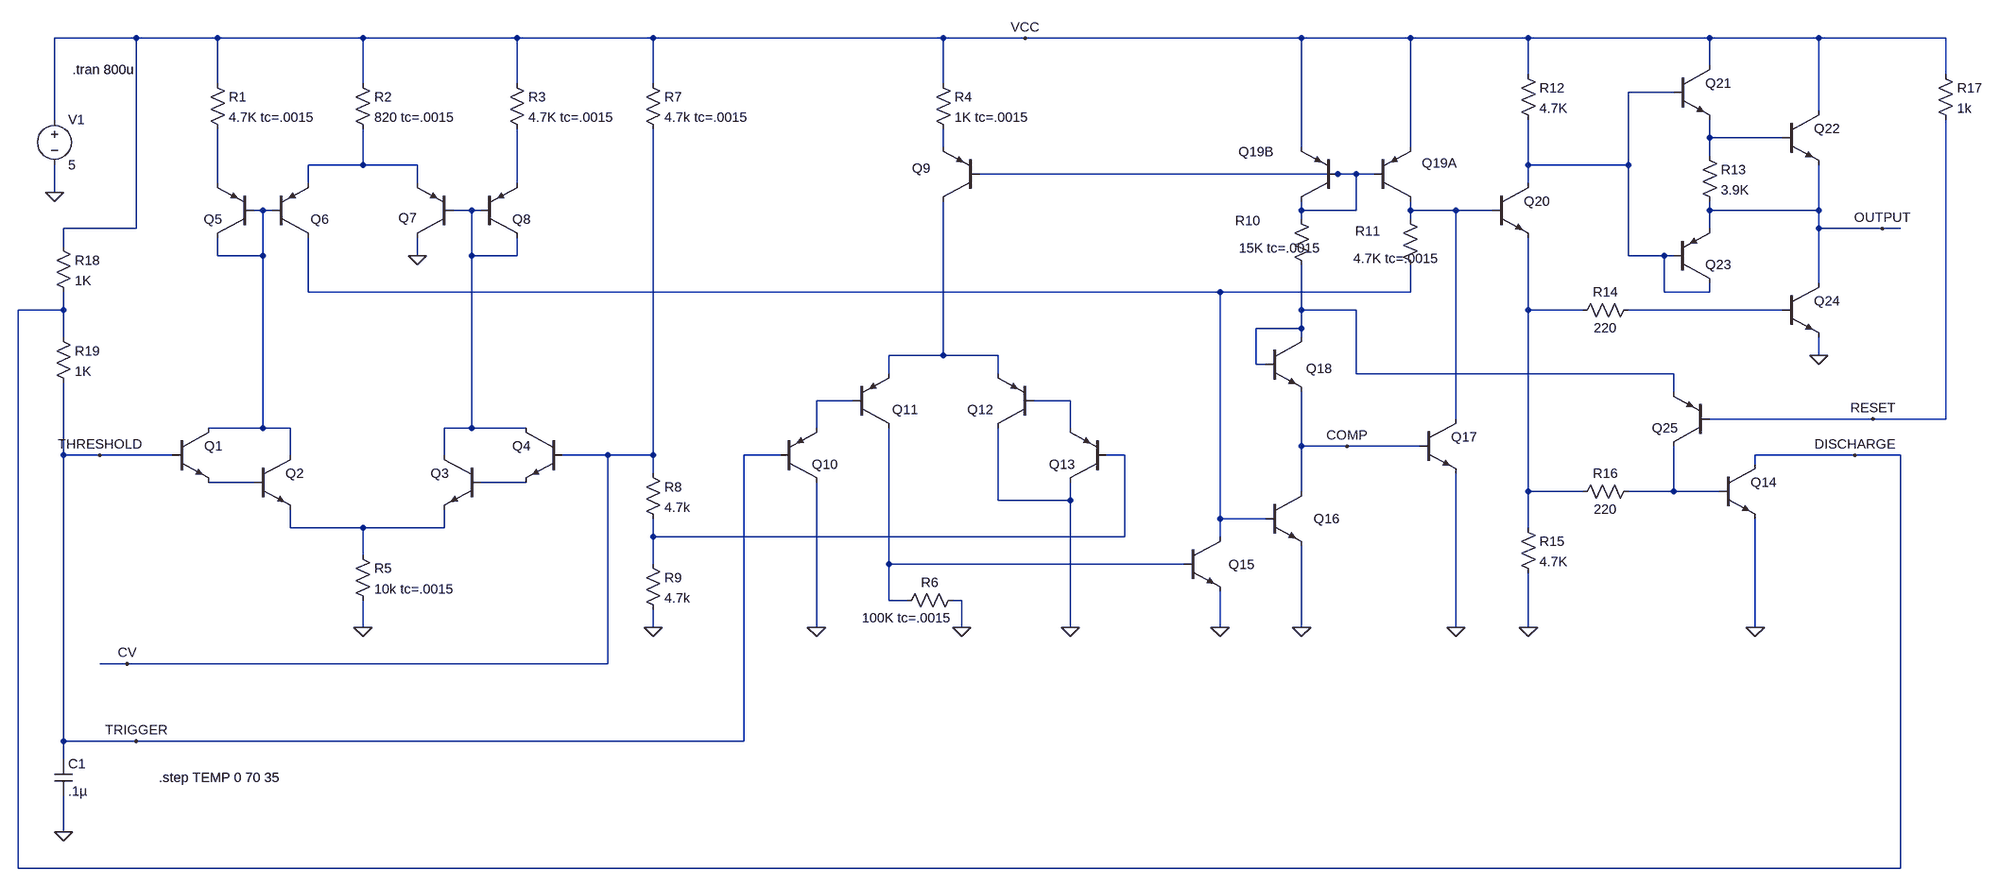
[diagram p0: schematic ne555.asc]
ne555.asc, the LTspice schematic file:
Version 4
SHEET 1 2928 1140
WIRE -384 -352 -528 -352
WIRE -240 -352 -384 -352
WIRE 16 -352 -240 -352
WIRE 288 -352 16 -352
WIRE 528 -352 288 -352
WIRE 1040 -352 528 -352
WIRE 1184 -352 1040 -352
WIRE 1680 -352 1184 -352
WIRE 1872 -352 1680 -352
WIRE 2080 -352 1872 -352
WIRE 2400 -352 2080 -352
WIRE 2592 -352 2400 -352
WIRE 2816 -352 2592 -352
WIRE 2400 -304 2400 -352
WIRE 2080 -288 2080 -352
WIRE 2816 -288 2816 -352
WIRE -240 -272 -240 -352
WIRE 16 -272 16 -352
WIRE 288 -272 288 -352
WIRE 528 -272 528 -352
WIRE 1040 -272 1040 -352
WIRE 2336 -256 2256 -256
WIRE 2592 -224 2592 -352
WIRE -528 -208 -528 -352
WIRE 2400 -176 2400 -208
WIRE 2528 -176 2400 -176
WIRE 1040 -160 1040 -192
WIRE 1680 -160 1680 -352
WIRE 1872 -160 1872 -352
WIRE 2400 -144 2400 -176
WIRE 16 -128 16 -192
WIRE 16 -128 -80 -128
WIRE 112 -128 16 -128
WIRE 2080 -128 2080 -208
WIRE 2256 -128 2256 -256
WIRE 2256 -128 2080 -128
WIRE 1744 -112 1104 -112
WIRE 1776 -112 1744 -112
WIRE 1808 -112 1776 -112
WIRE -240 -96 -240 -192
WIRE -80 -96 -80 -128
WIRE 112 -96 112 -128
WIRE 288 -96 288 -192
WIRE 2080 -96 2080 -128
WIRE -528 -80 -528 -128
WIRE -160 -48 -176 -48
WIRE -144 -48 -160 -48
WIRE 208 -48 176 -48
WIRE 224 -48 208 -48
WIRE 1680 -48 1680 -64
WIRE 1776 -48 1776 -112
WIRE 1776 -48 1680 -48
WIRE 1872 -48 1872 -64
WIRE 1952 -48 1872 -48
WIRE 2016 -48 1952 -48
WIRE 2400 -48 2400 -64
WIRE 2592 -48 2592 -128
WIRE 2592 -48 2400 -48
WIRE 1680 -32 1680 -48
WIRE 1872 -32 1872 -48
WIRE -384 -16 -384 -352
WIRE -384 -16 -512 -16
WIRE 2400 -16 2400 -48
WIRE 2592 -16 2592 -48
WIRE 2704 -16 2592 -16
WIRE 2736 -16 2704 -16
WIRE -512 16 -512 -16
WIRE -240 32 -240 0
WIRE -160 32 -160 -48
WIRE -160 32 -240 32
WIRE 112 32 112 0
WIRE 208 32 208 -48
WIRE 288 32 288 0
WIRE 288 32 208 32
WIRE 2256 32 2256 -128
WIRE 2320 32 2256 32
WIRE 2336 32 2320 32
WIRE 2592 80 2592 -16
WIRE -80 96 -80 0
WIRE 1536 96 -80 96
WIRE 1872 96 1872 48
WIRE 1872 96 1536 96
WIRE 2320 96 2320 32
WIRE 2400 96 2400 80
WIRE 2400 96 2320 96
WIRE -512 128 -512 96
WIRE -512 128 -592 128
WIRE 1680 128 1680 48
WIRE 1776 128 1680 128
WIRE 2080 128 2080 0
WIRE 2176 128 2080 128
WIRE 2528 128 2256 128
WIRE 1680 160 1680 128
WIRE 1680 160 1600 160
WIRE -512 176 -512 128
WIRE 1680 176 1680 160
WIRE 1040 208 1040 -64
WIRE 1040 208 944 208
WIRE 1136 208 1040 208
WIRE 2592 208 2592 176
WIRE 1600 224 1600 160
WIRE 1616 224 1600 224
WIRE 944 240 944 208
WIRE 1136 240 1136 208
WIRE 1776 240 1776 128
WIRE 2336 240 1776 240
WIRE 2336 272 2336 240
WIRE 880 288 816 288
WIRE 1264 288 1200 288
WIRE 1952 320 1952 -48
WIRE 2688 320 2400 320
WIRE 2816 320 2816 -208
WIRE 2816 320 2688 320
WIRE -160 336 -160 32
WIRE -160 336 -256 336
WIRE -112 336 -160 336
WIRE 208 336 208 32
WIRE 208 336 160 336
WIRE 304 336 208 336
WIRE 816 336 816 288
WIRE 1264 336 1264 288
WIRE 1680 368 1680 272
WIRE 1760 368 1680 368
WIRE 1888 368 1760 368
WIRE -512 384 -512 256
WIRE -448 384 -512 384
WIRE -320 384 -448 384
WIRE -112 384 -112 336
WIRE 160 384 160 336
WIRE 448 384 368 384
WIRE 528 384 528 -192
WIRE 528 384 448 384
WIRE 752 384 688 384
WIRE 1360 384 1328 384
WIRE 2656 384 2480 384
WIRE 2736 384 2656 384
WIRE 2480 400 2480 384
WIRE 528 416 528 384
WIRE -176 432 -256 432
WIRE 304 432 224 432
WIRE 1680 448 1680 368
WIRE 2080 448 2080 128
WIRE 2176 448 2080 448
WIRE 2336 448 2336 368
WIRE 2336 448 2256 448
WIRE 2416 448 2336 448
WIRE 1136 464 1136 336
WIRE 1264 464 1264 432
WIRE 1264 464 1136 464
WIRE 1536 496 1536 96
WIRE 1616 496 1536 496
WIRE -112 512 -112 480
WIRE 16 512 -112 512
WIRE 160 512 160 480
WIRE 160 512 16 512
WIRE 2080 512 2080 448
WIRE 528 528 528 496
WIRE 1360 528 1360 384
WIRE 1360 528 528 528
WIRE 1536 528 1536 496
WIRE 16 560 16 512
WIRE 528 576 528 528
WIRE 944 576 944 336
WIRE 1472 576 944 576
WIRE 944 640 944 576
WIRE 976 640 944 640
WIRE 1072 640 1056 640
WIRE 16 688 16 640
WIRE 528 688 528 656
WIRE 816 688 816 432
WIRE 1072 688 1072 640
WIRE 1264 688 1264 464
WIRE 1536 688 1536 624
WIRE 1680 688 1680 544
WIRE 1952 688 1952 416
WIRE 2080 688 2080 592
WIRE 2480 688 2480 496
WIRE -400 752 -448 752
WIRE 448 752 448 384
WIRE 448 752 -400 752
WIRE -512 912 -512 384
WIRE -384 912 -512 912
WIRE 688 912 688 384
WIRE 688 912 -384 912
WIRE -512 944 -512 912
WIRE -512 1072 -512 1008
WIRE -592 1136 -592 128
WIRE 2736 1136 2736 384
WIRE 2736 1136 -592 1136
FLAG 112 32 0
FLAG 16 688 0
FLAG -528 -80 0
FLAG 528 688 0
FLAG 816 688 0
FLAG 1264 688 0
FLAG 1072 688 0
FLAG 1536 688 0
FLAG 1680 688 0
FLAG 1952 688 0
FLAG 2080 688 0
FLAG 2592 208 0
FLAG 2480 688 0
FLAG 1184 -352 VCC
FLAG 2704 -16 OUTPUT
FLAG 2688 320 RESET
FLAG 2656 384 DISCHARGE
FLAG -384 912 TRIGGER
FLAG -400 752 CV
FLAG -448 384 THRESHOLD
FLAG -512 1072 0
FLAG 1760 368 COMP
SYMBOL npn -320 336 R0
WINDOW 3 -9 127 Invisible 2
SYMATTR Value 2N3904
SYMATTR InstName Q1
SYMBOL npn -176 384 R0
WINDOW 3 56 68 Invisible 2
SYMATTR Value 2N3904
SYMATTR InstName Q2
SYMBOL npn 224 384 M0
WINDOW 3 56 68 Invisible 2
SYMATTR Value 2N3904
SYMATTR InstName Q3
SYMBOL npn 368 336 M0
WINDOW 3 12 129 Invisible 2
SYMATTR Value 2N3904
SYMATTR InstName Q4
SYMBOL pnp -176 0 R180
WINDOW 3 84 68 Invisible 2
SYMATTR Value 2N3906
SYMATTR InstName Q5
SYMBOL pnp -144 0 M180
WINDOW 0 68 32 Left 2
WINDOW 3 68 -10 Invisible 2
SYMATTR InstName Q6
SYMATTR Value 2N3906
SYMBOL pnp 176 0 R180
WINDOW 0 65 35 Left 2
WINDOW 3 67 68 Invisible 2
SYMATTR InstName Q7
SYMATTR Value 2N3906
SYMBOL pnp 224 0 M180
WINDOW 3 84 68 Invisible 2
SYMATTR Value 2N3906
SYMATTR InstName Q8
SYMBOL res -256 -288 R0
SYMATTR InstName R1
SYMATTR Value 4.7K tc=.0015
SYMBOL res 0 -288 R0
SYMATTR InstName R2
SYMATTR Value 820 tc=.0015
SYMBOL res 272 -288 R0
SYMATTR InstName R3
SYMATTR Value 4.7K tc=.0015
SYMBOL res 0 544 R0
SYMATTR InstName R5
SYMATTR Value 10k tc=.0015
SYMBOL res 512 400 R0
SYMATTR InstName R8
SYMATTR Value 4.7k
SYMBOL res 512 560 R0
SYMATTR InstName R9
SYMATTR Value 4.7k
SYMBOL res 512 -288 R0
SYMATTR InstName R7
SYMATTR Value 4.7k tc=.0015
SYMBOL voltage -528 -224 R0
WINDOW 123 0 0 Left 2
WINDOW 39 0 0 Left 2
SYMATTR InstName V1
SYMATTR Value 5
SYMBOL pnp 1104 -64 R180
WINDOW 0 87 58 Left 2
WINDOW 3 84 68 Invisible 2
SYMATTR InstName Q9
SYMATTR Value 2N3906
SYMBOL pnp 752 432 M180
WINDOW 3 84 68 Invisible 2
SYMATTR Value 2N3906
SYMATTR InstName Q10
SYMBOL pnp 880 336 M180
WINDOW 0 70 32 Left 2
WINDOW 3 68 68 Invisible 2
SYMATTR InstName Q11
SYMATTR Value 2N3906
SYMBOL pnp 1200 336 R180
WINDOW 0 72 32 Left 2
WINDOW 3 70 68 Invisible 2
SYMATTR InstName Q12
SYMATTR Value 2N3906
SYMBOL pnp 1328 432 R180
WINDOW 3 84 68 Invisible 2
SYMATTR Value 2N3906
SYMATTR InstName Q13
SYMBOL res 1024 -288 R0
SYMATTR InstName R4
SYMATTR Value 1K tc=.0015
SYMBOL res 960 656 R270
WINDOW 0 32 56 VTop 2
WINDOW 3 0 15 VBottom 2
SYMATTR InstName R6
SYMATTR Value 100K tc=.0015
SYMBOL npn 1472 528 R0
WINDOW 0 79 49 Left 2
WINDOW 3 56 68 Invisible 2
SYMATTR InstName Q15
SYMATTR Value 2N3904
SYMBOL npn 1616 448 R0
WINDOW 0 85 48 Left 2
WINDOW 3 56 68 Invisible 2
SYMATTR InstName Q16
SYMATTR Value 2N3904
SYMBOL npn 1888 320 R0
WINDOW 3 56 68 Invisible 2
SYMATTR Value 2N3904
SYMATTR InstName Q17
SYMBOL npn 1616 176 R0
WINDOW 0 72 55 Left 2
WINDOW 3 56 68 Invisible 2
SYMATTR InstName Q18
SYMATTR Value 2N3904
SYMBOL pnp 1744 -64 R180
WINDOW 0 114 87 Left 2
WINDOW 3 84 68 Invisible 2
SYMATTR InstName Q19B
SYMATTR Value 2N3906
SYMBOL pnp 1808 -64 M180
WINDOW 0 84 67 Left 2
WINDOW 3 84 68 Invisible 2
SYMATTR InstName Q19A
SYMATTR Value 2N3906
SYMBOL res 1664 -48 R0
WINDOW 0 -101 18 Left 2
WINDOW 3 -94 67 Left 2
SYMATTR InstName R10
SYMATTR Value 15K tc=.0015
SYMBOL res 1856 -48 R0
WINDOW 0 -81 37 Left 2
WINDOW 3 -85 85 Left 2
SYMATTR InstName R11
SYMATTR Value 4.7K tc=.0015
SYMBOL npn 2016 -96 R0
WINDOW 3 56 68 Invisible 2
SYMATTR Value 2N3904
SYMATTR InstName Q20
SYMBOL res 2064 -304 R0
SYMATTR InstName R12
SYMATTR Value 4.7K
SYMBOL res 2064 496 R0
SYMATTR InstName R15
SYMATTR Value 4.7K
SYMBOL npn 2336 -304 R0
WINDOW 3 56 68 Invisible 2
SYMATTR Value 2N3904
SYMATTR InstName Q21
SYMBOL pnp 2336 80 M180
WINDOW 3 84 68 Invisible 2
SYMATTR Value 2N3906
SYMATTR InstName Q23
SYMBOL npn 2528 -224 R0
WINDOW 3 56 68 Invisible 2
SYMATTR Value 2N3904
SYMATTR InstName Q22
SYMBOL res 2384 -160 R0
SYMATTR InstName R13
SYMATTR Value 3.9K
SYMBOL npn 2528 80 R0
WINDOW 3 56 68 Invisible 2
SYMATTR Value 2N3904
SYMATTR InstName Q24
SYMBOL res 2272 112 R90
WINDOW 0 0 56 VBottom 2
WINDOW 3 32 56 VTop 2
SYMATTR InstName R14
SYMATTR Value 220
SYMBOL npn 2416 400 R0
WINDOW 3 56 68 Invisible 2
SYMATTR Value 2N3904
SYMATTR InstName Q14
SYMBOL res 2272 432 R90
WINDOW 0 0 56 VBottom 2
WINDOW 3 32 56 VTop 2
SYMATTR InstName R16
SYMATTR Value 220
SYMBOL pnp 2400 368 R180
WINDOW 3 84 68 Invisible 2
SYMATTR Value 2N3906
SYMATTR InstName Q25
SYMBOL res 2800 -304 R0
SYMATTR InstName R17
SYMATTR Value 1k
SYMBOL cap -528 944 R0
SYMATTR InstName C1
SYMATTR Value .1µ
SYMATTR SpiceLine2 IC=2.5
SYMBOL res -528 160 R0
SYMATTR InstName R19
SYMATTR Value 1K
SYMBOL res -528 0 R0
SYMATTR InstName R18
SYMATTR Value 1K
TEXT -496 -296 Left 2 !.tran 800u
TEXT -344 976 Left 2 !.step TEMP 0 70 35

The netlist it stands for:
* ne555.asc
Q1 N008 THRESHOLD N019 0 2N3904
Q2 N008 N019 N022 0 2N3904
Q3 N009 N020 N022 0 2N3904
Q4 N009 CV N020 0 2N3904
Q5 N008 N008 N006 0 2N3906
Q6 N011 N008 N004 0 2N3906
Q7 0 N009 N004 0 2N3906
Q8 N009 N009 N007 0 2N3906
R1 VCC N006 4.7K tc=.0015
R2 VCC N004 820 tc=.0015
R3 VCC N007 4.7K tc=.0015
R5 N022 0 10k tc=.0015
R8 CV N018 4.7k
R9 N018 0 4.7k
R7 VCC CV 4.7k tc=.0015
V1 VCC 0 5
Q9 N015 N005 N003 0 2N3906
Q10 0 THRESHOLD N016 0 2N3906
Q11 N023 N016 N015 0 2N3906
Q12 0 N017 N015 0 2N3906
Q13 0 N018 N017 0 2N3906
R4 VCC N003 1K tc=.0015
R6 N023 0 100K tc=.0015
Q15 N011 N023 0 0 2N3904
Q16 COMP N011 0 0 2N3904
Q17 N010 COMP 0 0 2N3904
Q18 N012 N012 COMP 0 2N3904
Q19B N005 N005 VCC 0 2N3906
Q19A N010 N005 VCC 0 2N3906
R10 N005 N012 15K tc=.0015
R11 N010 N011 4.7K tc=.0015
Q20 N001 N010 N013 0 2N3904
R12 VCC N001 4.7K
R15 N013 0 4.7K
Q21 VCC N001 N002 0 2N3904
Q23 N001 N001 OUTPUT 0 2N3906
Q22 VCC N002 OUTPUT 0 2N3904
R13 N002 OUTPUT 3.9K
Q24 OUTPUT N014 0 0 2N3904
R14 N014 N013 220
Q14 DISCHARGE N021 0 0 2N3904
R16 N021 N013 220
Q25 N021 RESET N012 0 2N3906
R17 VCC RESET 1k
C1 THRESHOLD 0 .1µ IC=2.5
R19 DISCHARGE THRESHOLD 1K
R18 VCC DISCHARGE 1K
.model NPN NPN
.model PNP PNP
.lib standard.bjt
.tran 800u
.step TEMP 0 70 35
.backanno
.end